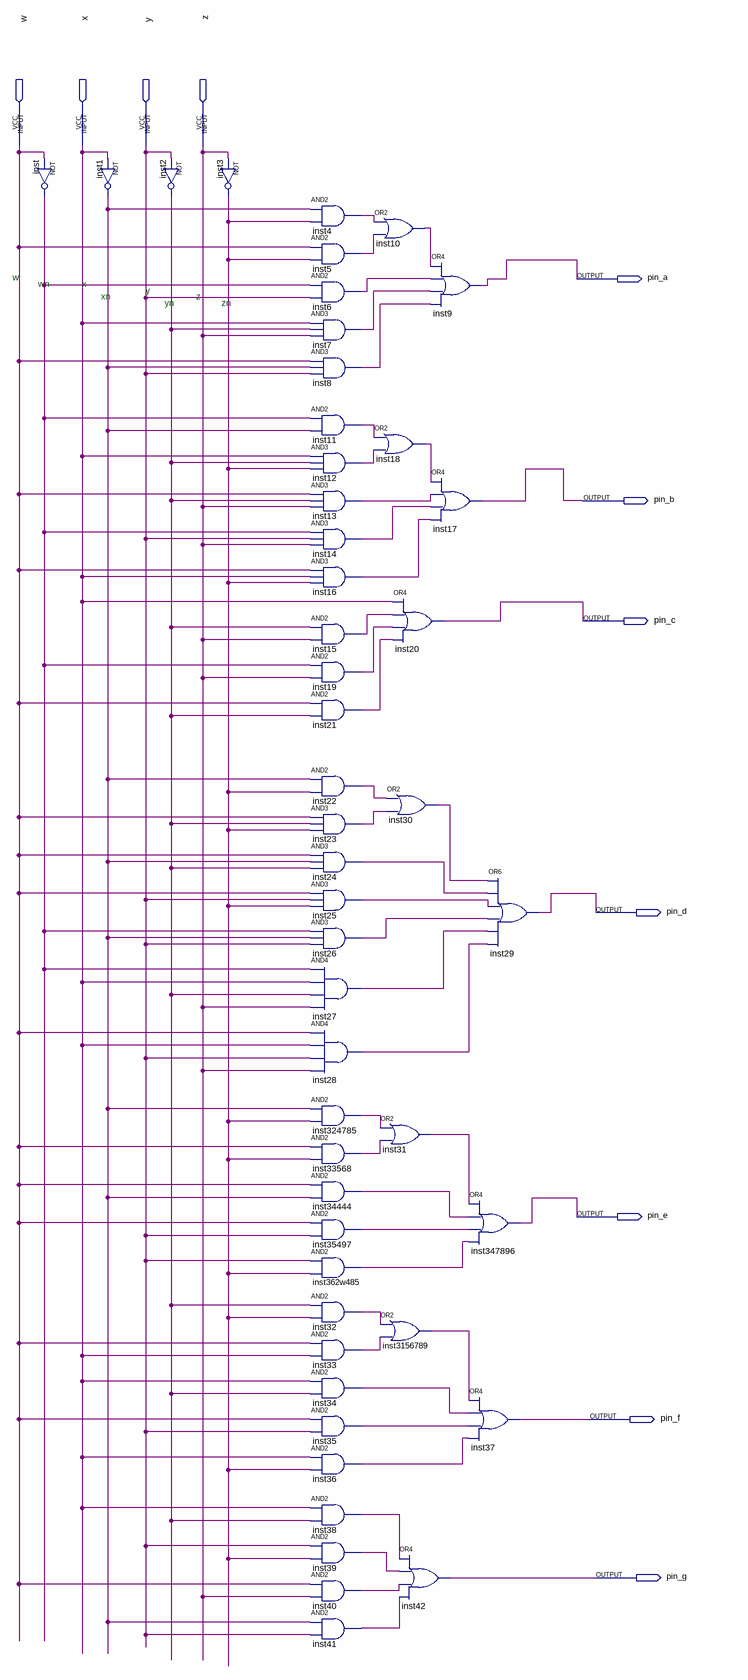
[diagram p0: schematic sheet]
// Quartus schematic lab4.bdf as structural Verilog: 50 symbols, 11 pins
module lab4 (
  input  w,
  input  x,
  input  y,
  input  z,
  output pin_a,
  output pin_b,
  output pin_c,
  output pin_d,
  output pin_e,
  output pin_f,
  output pin_g
);

  wire inst1_out, inst2_out, inst3_out, inst4_out, inst5_out, inst6_out, inst7_out, inst8_out, inst10_out,
       inst11_out, inst12_out, inst13_out, inst14_out, inst15_out, inst16_out, inst18_out, inst19_out,
       inst21_out, inst22_out, inst23_out, inst24_out, inst25_out, inst26_out, inst27_out, inst28_out,
       inst30_out, inst31_out, inst32_out, inst33_out, inst34_out, inst35_out, inst36_out, inst38_out,
       inst39_out, inst40_out, inst41_out, inst362w485_out, inst33568_out, inst34444_out, inst35497_out,
       inst324785_out, inst3156789_out, inst_out;

  not inst (inst_out, w);
  not inst1 (inst1_out, x);
  not inst2 (inst2_out, y);
  not inst3 (inst3_out, z);
  and inst4 (inst4_out, inst1_out, inst3_out);
  and inst5 (inst5_out, w, inst3_out);
  and inst6 (inst6_out, inst_out, y);
  and inst7 (inst7_out, x, inst2_out, z);
  and inst8 (inst8_out, w, inst1_out, y);
  and inst11 (inst11_out, inst_out, inst1_out);
  and inst12 (inst12_out, x, inst2_out, inst3_out);
  and inst13 (inst13_out, w, inst2_out, z);
  and inst14 (inst14_out, inst_out, y, z);
  and inst16 (inst16_out, w, x, inst3_out);
  and inst15 (inst15_out, inst2_out, z);
  and inst19 (inst19_out, inst_out, z);
  and inst21 (inst21_out, w, inst2_out);
  and inst22 (inst22_out, inst1_out, inst3_out);
  and inst23 (inst23_out, w, inst2_out, inst3_out);
  and inst24 (inst24_out, w, inst1_out, inst2_out);
  and inst25 (inst25_out, w, y, inst3_out);
  and inst26 (inst26_out, inst_out, inst1_out, y);
  and inst27 (inst27_out, inst_out, x, inst2_out, z);
  and inst28 (inst28_out, w, x, y, z);
  and inst324785 (inst324785_out, inst1_out, inst3_out);
  and inst33568 (inst33568_out, w, inst3_out);
  and inst34444 (inst34444_out, w, inst1_out);
  and inst35497 (inst35497_out, w, y);
  and inst362w485 (inst362w485_out, y, inst3_out);
  and inst32 (inst32_out, inst2_out, inst3_out);
  and inst33 (inst33_out, w, x);
  and inst34 (inst34_out, x, inst2_out);
  and inst35 (inst35_out, w, y);
  and inst36 (inst36_out, x, inst3_out);
  and inst38 (inst38_out, x, inst2_out);
  and inst39 (inst39_out, y, inst3_out);
  and inst40 (inst40_out, w, z);
  and inst41 (inst41_out, inst1_out, y);
  or inst10 (inst10_out, inst4_out, inst5_out);
  or inst18 (inst18_out, inst11_out, inst12_out);
  or inst20 (pin_c, x, inst15_out, inst19_out, inst21_out);
  or inst30 (inst30_out, inst22_out, inst23_out);
  or inst31 (inst31_out, inst324785_out, inst33568_out);
  or inst3156789 (inst3156789_out, inst32_out, inst33_out);
  or inst42 (pin_g, inst38_out, inst39_out, inst40_out, inst41_out);
  or inst9 (pin_a, inst10_out, inst6_out, inst7_out, inst8_out);
  or inst17 (pin_b, inst18_out, inst13_out, inst14_out, inst16_out);
  or inst29 (pin_d, inst30_out, inst24_out, inst25_out, inst26_out, inst27_out, inst28_out);
  or inst347896 (pin_e, inst31_out, inst34444_out, inst35497_out, inst362w485_out);
  or inst37 (pin_f, inst3156789_out, inst34_out, inst35_out, inst36_out);

  // Notes on the sheet:
  //   w
  //   wn
  //   x
  //   y
  //   xn
  //   z
  //   yn
  //   zn
endmodule
